# Altium schematic sheet H-Bridge turning Sch.SchDoc
size A4
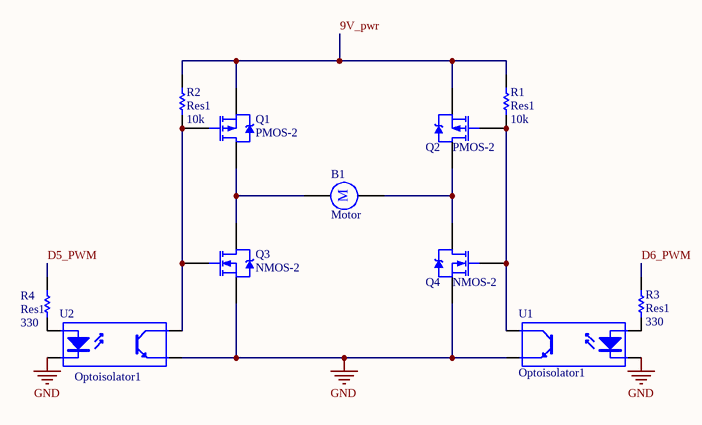
[diagram p0: H-Bridge turning Sch.SchDoc]

## Parts
B1  Motor  [HDR1X2]
Q1  PMOS-2  [TO-220AB]
Q2  PMOS-2  [TO-220AB]
Q3  NMOS-2  [TO-220AB]
Q4  NMOS-2  [TO-220AB]
R1  Res1  value 10k  [6-0805_N]
R2  Res1  value 10k  [6-0805_N]
R3  Res1  value 330  [6-0805_N]
R4  Res1  value 330  [6-0805_N]
U1  Optoisolator1  [DIP-4]
U2  Optoisolator1  [DIP-4]

## Nets
GND: Q3.3(S) Q4.3(S) U1.2(K) U1.3(E) U2.2(K) U2.3(E)
9V_pwr: Q1.3(S) Q2.3(S) R1.2 R2.2
D5_PWM: R4.2
D6_PWM: R3.2
NetB1_1: B1.1 Q1.2(D) Q3.2(D)
NetB1_2: B1.2 Q2.2(D) Q4.2(D)
NetQ1_1: Q1.1(G) Q3.1(G) R2.1 U2.4(C)
NetQ2_1: Q2.1(G) Q4.1(G) R1.1 U1.4(C)
NetR3_1: R3.1 U1.1(A)
NetR4_1: R4.1 U2.1(A)

## Notes on the sheet
- (in symbol Motor) M

## Library data of the parts
B1 = Motor: Motor, General Kind; Published: 24-Mar-1999; LatestRevisionDate: 17-Jul-2002; LatestRevisionNote: Re-released for DXP Platform.; PackageReference: RB5-10.5; Publisher: Altium Limited; PackageDescription: Capacitor (Radial); 2 Leads
Q1 Q2 = PMOS-2: P-Channel Power MOSFET; Note: Pin 4 not drawn and electrically connected to Pin 2.; Published: 8-Jun-2000; LatestRevisionDate: 17-Jul-2002; LatestRevisionNote: Re-released for DXP Platform.; DatasheetVersion: PD-9.390D; PackageVersion: Feb-1997; PackageReference: TO-220AB; Publisher: Altium Limited; PackageDescription: TO, Thru-Hole, Vertical, Heatsink Mounted; 3 In-Line Leads; Pitch 2.54 mm; ComponentLink1Description: Manufacturer Link; ComponentLink1URL: http://www.irf.com/
Q3 Q4 = NMOS-2: N-Channel Power MOSFET; Note: Pin 2 is electrically connected to pin 4.; Published: 8-Jun-2000; LatestRevisionDate: 17-Jul-2002; LatestRevisionNote: Re-released for DXP Platform.; DatasheetVersion: PD-9.814; PackageVersion: Feb-1997; PackageReference: TO-220AB; Publisher: Altium Limited; PackageDescription: TO, Thru-Hole, Vertical, Heatsink Mounted; 3 In-Line Leads; Pitch 2.54 mm; ComponentLink1Description: Manufacturer Link; ComponentLink1URL: http://www.irf.com/
R1-R4 = Res1: Resistor; Published: 8-Jun-2000; LatestRevisionDate: 17-Jul-2002; LatestRevisionNote: Re-released for DXP Platform.; PackageReference: AXIAL-0.3; Publisher: Altium Limited; PackageDescription: Axial Device, Thru-Hole; 2 Leads; 0.3 in Pin Spacing
U1 U2 = Optoisolator1: 4-Pin Phototransistor Optocoupler; Published: 24-Mar-1999; LatestRevisionDate: 04-Mar-2005; LatestRevisionNote: Sch pins 3 & 4 Swapped.; DatasheetVersion: Nov-2003; PackageReference: DIP-4; Publisher: Altium Limited